# EAGLE design ade7953 (EAGLE 7.2.0)
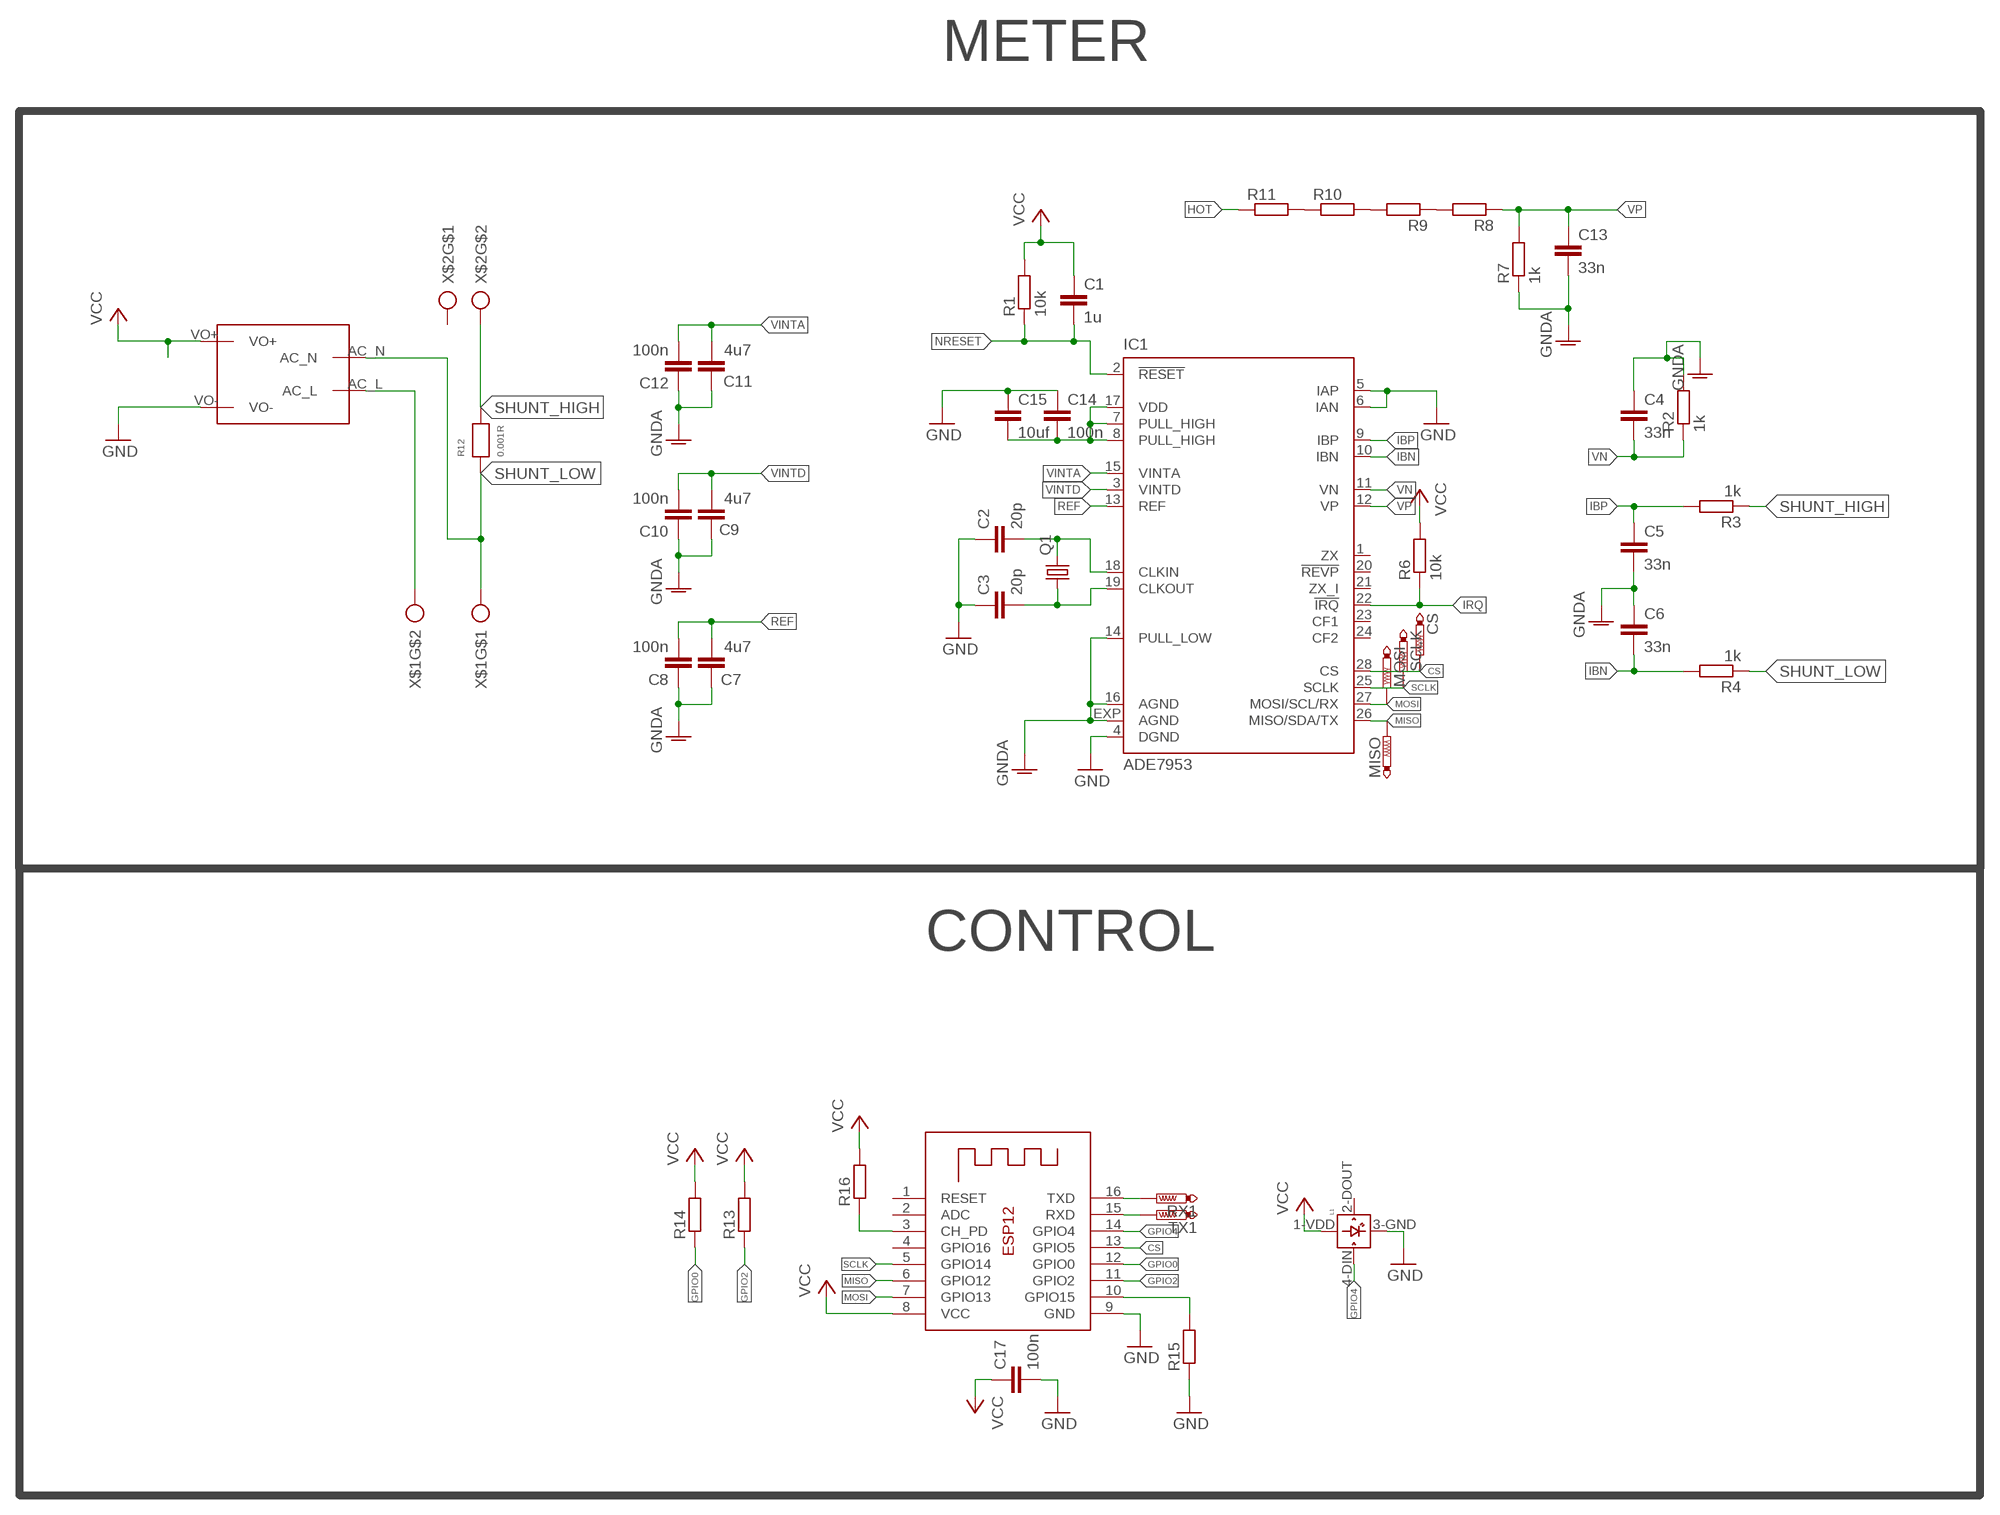
[diagram p0: schematic, sheet 1]

## Parts
C1  1u  C-EUC0805  [C0805]
C2  20p  C-EUC0805  [C0805]
C3  20p  C-EUC0805  [C0805]
C4  33n  C-EUC0805  [C0805]
C5  33n  C-EUC0805  [C0805]
C6  33n  C-EUC0805  [C0805]
C7  4u7  C-EUC0805  [C0805]
C8  100n  C-EUC0805  [C0805]
C9  4u7  C-EUC0805  [C0805]
C10  100n  C-EUC0805  [C0805]
C11  4u7  C-EUC0805  [C0805]
C12  100n  C-EUC0805  [C0805]
C13  33n  C-EUC0805  [C0805]
C14  100n  C-EUC0805  [C0805]
C15  10uf  C-EUC0805  [C0805]
C17  100n  C-EUC0805  [C0805]
CS  PTR1B1,27  [B1,27]
IC1  ADE7953  [QFN28-ML]
L1  WS2812B  [WS2812B]
MISO  PTR1B1,27  [B1,27]
MOSI  PTR1B1,27  [B1,27]
Q1  CRYSTALHC49UP  [HC49UP]
R1  10k  R-EU_R0805  [R0805]
R2  1k  R-EU_R0805  [R0805]
R3  1k  R-EU_R0805  [R0805]
R4  1k  R-EU_R0805  [R0805]
R6  10k  R-EU_R0805  [R0805]
R7  1k  R-EU_R0805  [R0805]
R8  R-EU_R0805  [R0805]
R9  R-EU_R0805  [R0805]
R10  R-EU_R1206  [R1206]
R11  R-EU_R1206  [R1206]
R12  0.001R  WSR-2_SHUNT  [WRS-2_4527]
R13  R-EU_R0603  [R0603]
R14  R-EU_R0603  [R0603]
R15  R-EU_R0603  [R0603]
R16  R-EU_R0603  [R0603]
RX1  PTR1B1,27  [B1,27]
SCLK  PTR1B1,27  [B1,27]
TX1  PTR1B1,27  [B1,27]
U$1  MAINS_CONVERTERS  [HLK-PM01]
X3  ESP-12  [ESP-12]
X$1  ARK2  [ARK2]
X$2  ARK2  [ARK2]

## Nets
CLKIN: C2.2 IC1.18(CLKIN) Q1.2
CLKOUT: C3.2 IC1.19(CLKOUT) Q1.1
CS: CS.TP IC1.28(CS) X3.13(GPIO5)
GND: C2.1 C3.1 C14.1 C15.1 C17.2 IC1.4(DGND) IC1.5(IAP) IC1.6(IAN) L1.3-GND(GND) R15.1 U$1.VO- X3.9(GND)
GNDA: C4.1 C5.2 C6.1 C7.1 C8.1 C9.1 C10.1 C11.1 C12.1 C13.2 IC1.14(PULL_LOW) IC1.16(AGND) IC1.EXP(AGND) R2.2 R7.1
GPIO0: R14.1 X3.12(GPIO0)
GPIO2: R13.1 X3.11(GPIO2)
GPIO4: L1.4-DIN(DIN) X3.14(GPIO4)
GPIO15: R15.2 X3.10(GPIO15)
HOT: R11.1 U$1.AC_L X$1.2
IBN: C6.2 IC1.10(IBN) R4.2
IBP: C5.1 IC1.9(IBP) R3.2
IRQ: IC1.22(!IRQ!) R6.1
MISO: IC1.26(MISO/SDA/TX) MISO.TP X3.6(GPIO12)
MOSI: IC1.27(MOSI/SCL/RX) MOSI.TP X3.7(GPIO13)
N$1: R9.2 R10.2
N$2: R10.1 R11.2
N$4: R16.1 X3.3(CH_PD)
N$12: R8.2 R9.1
NRESET: C1.2 IC1.2(!RESET!) R1.1
REF: C7.2 C8.2 IC1.13(REF)
RX: TX1.TP X3.15(RXD)
SCLK: IC1.25(SCLK) SCLK.TP X3.5(GPIO14)
SHUNT_HIGH: R3.1 R12.2 X$2.2
SHUNT_LOW: R4.1 R12.1 U$1.AC_N X$1.1
TX: RX1.TP X3.16(TXD)
VCC: C1.1 C14.2 C15.2 C17.1 IC1.7(PULL_HIGH) IC1.8(PULL_HIGH) IC1.17(VDD) L1.1-VDD(VDD) R1.2 R6.2 R13.2 R14.2 R16.2 U$1.VO+ X3.8(VCC)
VINTA: C11.2 C12.2 IC1.15(VINTA)
VINTD: C9.2 C10.2 IC1.3(VINTD)
VN: C4.2 IC1.11(VN) R2.1
VP: C13.1 IC1.12(VP) R7.2 R8.1
Unconnected: IC1.1(ZX) IC1.20(!REVP!) IC1.21(ZX_I) IC1.23(CF1) IC1.24(CF2) L1.2-DOUT(DOUT) X3.1(RESET) X3.2(ADC) X3.4(GPIO16) X$2.1

## Notes on the sheet
- METER
- CONTROL

## Library data of the parts
C1-C15 C17 = rcl:C-EU: CAPACITOR, European symbol
CS MISO MOSI RX1 SCLK TX1 = testpad:PTR1: TEST PIN
IC1 = ADE7953:ADE7953: Single Phase, Multifunction Metering IC with Neutral Current Measurement Source: http://www.analog.com/static/imported-files/data_sheets/ADE7953.pdf http://www.analog.com/static/imported-files/jp/data_sheets/ADE7953_jp.pdf
L1 = adafruit:WS2812B
Q1 = adafruit:CRYSTAL: CRYSTAL; OC_FARNELL: unknown; OC_NEWARK: unknown
R1-R4 R6-R11 R13-R16 = rcl:R-EU_: RESISTOR, European symbol
R12 = WSR-2_SHUNT:WSR-2_SHUNT
U$1 = _HLK:MAINS_CONVERTERS
X3 = adafruit:ESP-12
X$1 X$2 = _ARK:ARK2

## Board
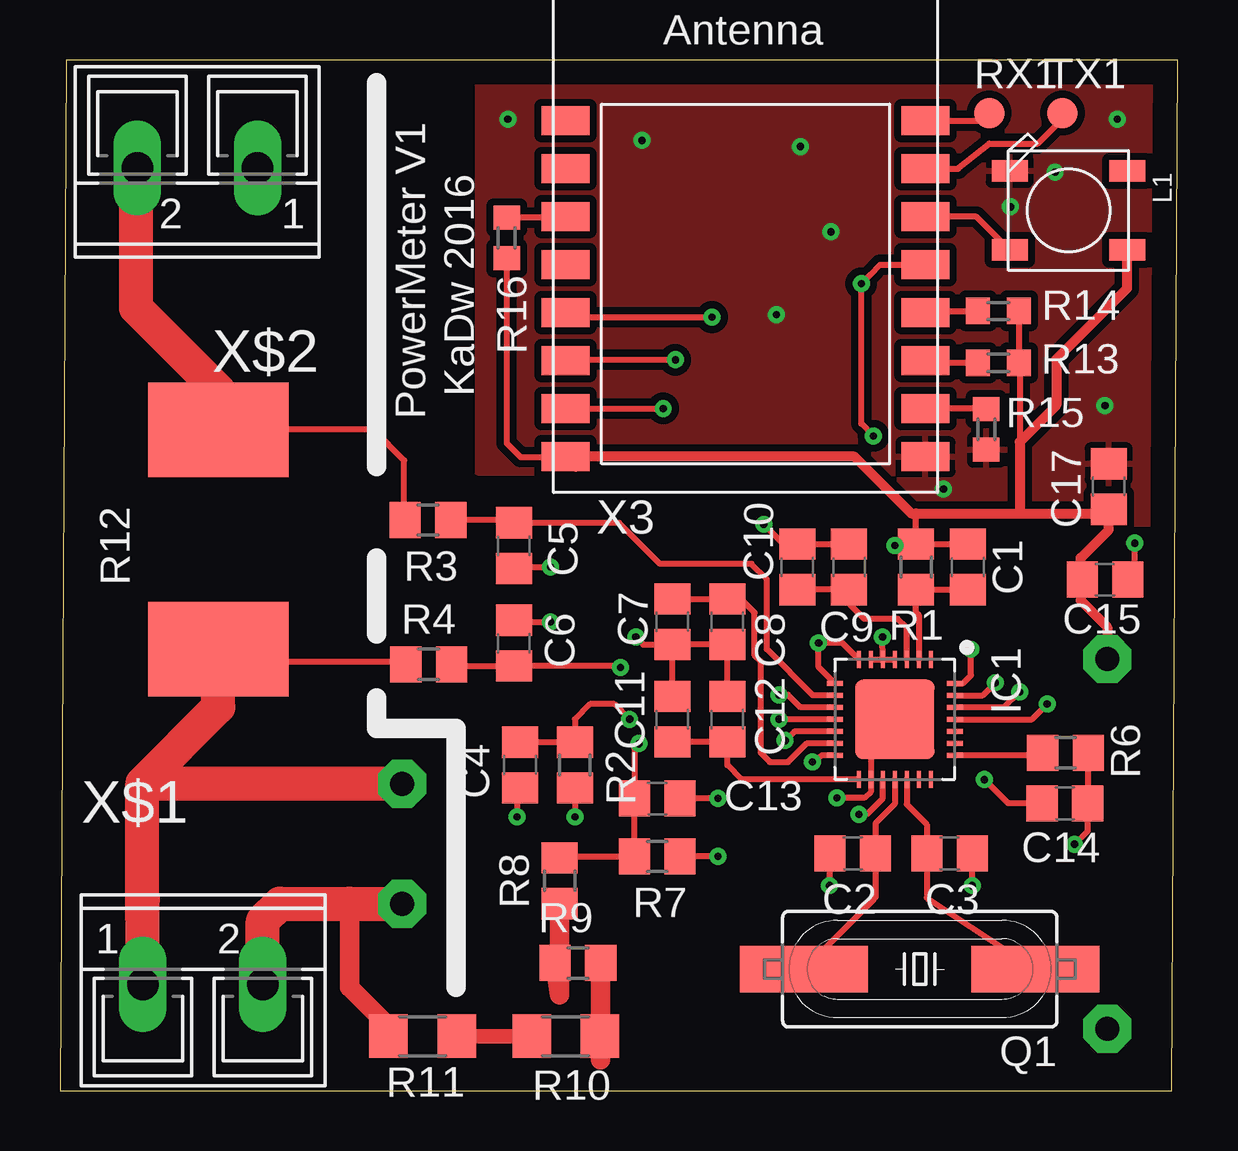
[diagram p1: board, top side]
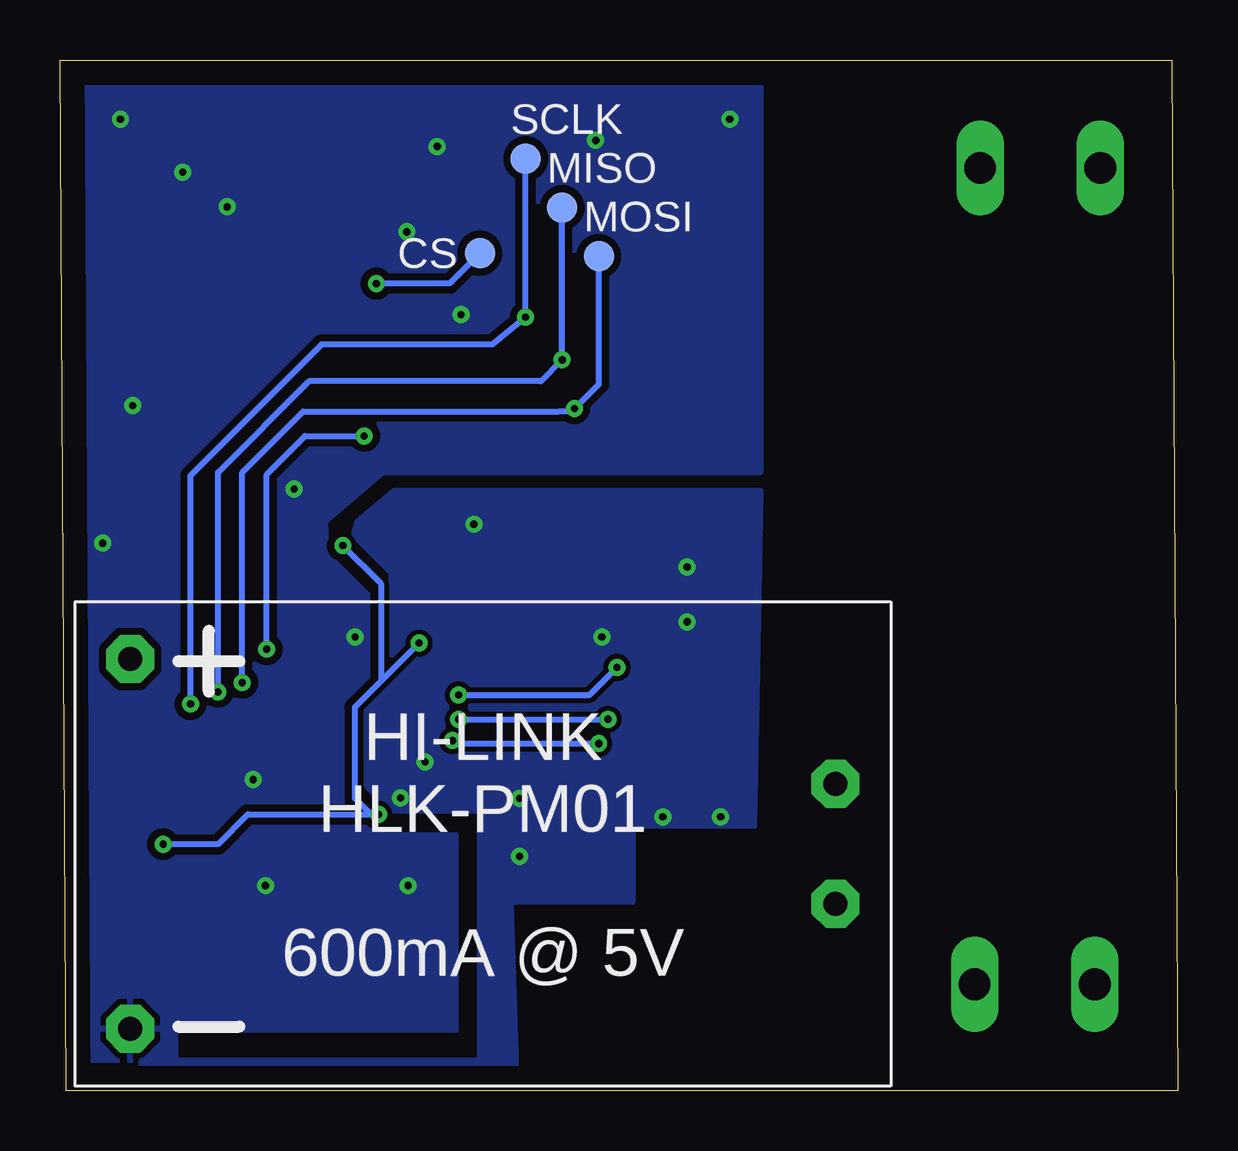
[diagram p2: board, bottom side, seen from below]

Size 46.59 x 42.98 mm. Coordinates in mm from the lower left corner, seen from the top.
Outline: 0,0 46.34,0 46.59,42.98 0.25,42.98 0,0
Copper layers (1*16): Top 0.035mm / dielectric 1.5mm / Bottom 0.035mm
Design rules "default": minimum track width 10mil, minimum drill 24mil, track to track 8mil, track to pad 8mil, pad to pad 8mil, via to via 8mil, smd to smd 8mil, copper to edge 40mil, drill to drill 8mil, minimum pad ring 10mil, minimum via ring 8mil, stop-mask expansion 4mil, vias tented up to drill 0mil, thermal gap 10mil

### Footprints (pad centres in the part's own frame; a part is rotated, then mirrored left to right if it is on the bottom)
C0805 = smd 1.3 x 1.5: 1 -0.95,0; 2 0.95,0
B1,27 = smd 1.27 x 1.27: TP 0,0
QFN28-ML = smd 0.7 x 0.2: 1 -2.5,1.5; 2 -2.5,1; 3 -2.5,0.5; 4 -2.5,0; 5 -2.5,-0.5; 6 -2.5,-1; 7 -2.5,-1.5; 15 2.5,-1.5; 16 2.5,-1; 17 2.5,-0.5; 18 2.5,0; 19 2.5,0.5; 20 2.5,1; 21 2.5,1.5 | smd 0.2 x 0.7: 8 -1.5,-2.5; 9 -1,-2.5; 10 -0.5,-2.5; 11 0,-2.5; 12 0.5,-2.5; 13 1,-2.5; 14 1.5,-2.5; 22 1.5,2.5; 23 1,2.5; 24 0.5,2.5; 25 0,2.5; 26 -0.5,2.5; 27 -1,2.5; 28 -1.5,2.5 | smd 3.3 x 3.3: EXP 0,0
WS2812B = smd 1.5 x 0.9: 1-VDD 2.45,-1.65; 2-DOUT 2.45,1.65; 3-GND -2.45,1.65; 4-DIN -2.45,-1.65
HC49UP = smd 5.334 x 1.93: 1 -4.826,0; 2 4.826,0
R0805 = smd 1.3 x 1.5: 1 -0.95,0; 2 0.95,0
R1206 = smd 1.6 x 1.803: 1 -1.422,0; 2 1.422,0
WRS-2_4527 = smd 3.94 x 5.84: 1 -4.575,0; 2 4.575,0
R0603 = smd 1 x 1.1: 1 -0.85,0; 2 0.85,0
HLK-PM01 = drill 1 pad 2 octagon: AC_L -14.7,2.5; AC_N -14.7,-2.5; VO+ 14.7,-7.7; VO- 14.7,7.7
ESP-12 = smd 2 x 1.2: 1 -7.5,4.5; 2 -7.5,2.5; 3 -7.5,0.5; 4 -7.5,-1.5; 5 -7.5,-3.5; 6 -7.5,-5.5; 7 -7.5,-7.5; 8 -7.5,-9.5; 9 7.5,-9.5; 10 7.5,-7.5; 11 7.5,-5.5; 12 7.5,-3.5; 13 7.5,-1.5; 14 7.5,0.5; 15 7.5,2.5; 16 7.5,4.5
ARK2 = drill 1.321 long: 1 -2.515,0; 2 2.489,0

### Placement (x,y rotation side)
C1  37.85,21.84 270 top
C2  33.05,9.91 0 top
C3  37.08,9.91 180 top
C4  19.18,13.59 90 top
C5  18.92,22.73 270 top
C6  18.92,18.67 270 top
C7  25.53,19.56 90 top
C8  27.81,19.56 90 top
C9  32.89,21.84 270 top
C10  30.73,21.84 270 top
C11  25.53,15.49 270 top
C12  27.81,15.49 270 top
C13  24.89,12.19 0 top
C14  41.88,11.99 0 top
C15  43.56,21.31 180 top
C17  43.71,25.2 90 top
CS  29.08,34.92 0 bottom
IC1  34.8,15.49 270 top
L1  42.04,36.7 0 top
MISO  25.65,36.83 0 bottom
MOSI  24.13,34.8 0 bottom
Q1  35.84,5.08 180 top
R1  35.69,21.84 90 top
R2  21.46,13.59 270 top
R3  15.34,23.8 0 top
R4  15.37,17.78 0 top
R6  41.91,14.1 0 top
R7  24.89,9.78 180 top
R8  20.83,8.76 270 top
R9  21.59,5.33 0 top
R10  21.08,2.29 0 top
R11  15.11,2.29 0 top
R12  6.6,22.99 90 top
R13  39.12,30.35 0 top
R14  39.12,32.51 0 top
R15  38.61,27.58 90 top
R16  18.62,35.56 270 top
RX1  38.73,40.77 0 top
SCLK  27.18,38.86 0 bottom
TX1  41.78,40.77 0 top
U$1  28.96,10.3 180 bottom
X3  28.57,35.94 0 top
X$1  5.97,4.45 0 top
X$2  5.71,38.48 180 top

### Tracks (layer width: path | path; a pad name or v marks a point on that pad's centre or on a via)
CLKIN
  Top 0.254: IC1.18 34.8,11.96 33.99,11.16 C2.2 33.99,8.09 33.91,8 33.91,7.98 Q1.2
CLKOUT
  Top 0.254: IC1.19 35.3,11.95 36.13,11.11 C3.2 36.13,8.06 36.2,8 Q1.1
CS  (via drill 0.3)
  Top 0.254: IC1.28 arc90 IC1.28 37.64,16.99 37.97,17.32 v37.97,18.41 | v33.91,27.3 33.4,27.81 v33.4,33.65 33.78,34.04 34.19,34.44 X3.13
  Bottom 0.254: v37.97,18.41 37.97,25.7 36.37,27.3 v33.91,27.3 | CS.TP 30.35,33.65 v33.4,33.65
GND  (via drill 0.3)
  Top 0.254: IC1.6 IC1.5 | IC1.5 IC1.4 | IC1.5 v34.29,18.92 | C2.1 32.08,8.88 v32.08,8.56 | v38.02,8.56 38.03,8.7 C3.1 | C14.1 39.52,11.99 v38.53,12.98 | C15.1 44.81,21.6 v44.81,22.84
  other vias: 18.67,40.51 24.26,39.62 43.56,28.57 41.48,38.3 32.13,35.81 36.83,25.1 30.86,39.37 29.87,32.36 44.07,40.51 39.62,36.86
  pour Bottom (isolate 0.305): 17.4,43.69 17.4,25.78 33.15,25.78 35.56,23.72 35.43,22.35 33.78,20.7 33.78,17.15 34.8,16.13 34.8,12.32 33.15,10.67 30.1,10.67 30.1,2.54 41.78,2.54 41.78,1.27 47.12,1.27 47.12,43.69
  pour Top (isolate 0.305): 17.4,43.31 17.4,25.78 33.15,25.78 35.56,23.72 48.51,23.62 48.51,43.31
GNDA  (via drill 0.3)
  Top 0.254: v27.43,12.19 C13.2 | v27.43,9.78 R7.1 | R2.2 v21.46,11.43 | C4.1 19.05,12.51 v19.05,11.43 | C6.1 18.98,19.56 v20.45,19.56 | C5.2 18.98,21.84 v20.45,21.84 | v24,18.92 24.32,18.61 C7.1 | C11.1 C7.1 | C12.1 C8.1 C7.1 | C9.1 C10.1 30.67,22.73 30.23,22.73 v29.34,23.62 | 32.3,12.28 v32.38,12.22 33.53,12.22 33.8,12.46 IC1.16 33.8,14.49 IC1.EXP | IC1.14 31.77,13.99 v31.37,13.72
  pour Bottom: 17.4,25.02 17.65,11.05 22.73,11.05 22.73,7.87 27.81,7.87 27.56,0.25 43.18,0.25 43.18,1.27 29.08,1.27 29.08,11.68 32.77,11.68 33.78,12.7 33.78,16 32.77,17.02 32.77,21.59 34.29,23.11 34.29,23.37 34.16,23.75 32.64,25.02
GPIO0
  Top 0.254: X3.12 36.15,32.51 R14.1
GPIO2
  Top 0.254: X3.11 36.16,30.35 R13.1
GPIO4
  Top 0.254: L1.4-DIN 38.2,36.44 X3.14
GPIO15
  Top 0.254: R15.2 X3.10
HOT
  Top 0.813: 12.06,7.8 12.06,4.32 13.69,2.69 R11.1
  Top 1.422: U$1.AC_L 12.06,7.8 9.17,7.8 8.46,7.09 X$1.2
IBN  (via drill 0.3)
  Top 0.254: IC1.10 30.87,15.99 30.35,16.51 v29.97,16.51 | v23.37,17.65 23.3,17.72 19.43,17.72 C6.2 16.38,17.72 R4.2
  Bottom 0.254: v29.97,16.51 24.51,16.51 v23.37,17.65
IBP
  Top 0.254: IC1.9 31.38,16.49 29.46,18.41 29.46,21.34 28.83,21.97 25.02,21.97 23.31,23.68 C5.1 18.81,23.8 R3.2
IRQ
  Top 0.254: R6.1 40.86,13.99 IC1.22
MISO  (via drill 0.3)
  Top 0.254: IC1.26 39.37,16 v40.01,16.64 | X3.6 21.11,30.48 v25.65,30.48
  Bottom 0.254: MISO.TP v25.65,30.48 26.54,29.59 36.2,29.59 40.01,25.78 v40.01,16.64
MOSI  (via drill 0.3)
  Top 0.254: IC1.27 38.47,16.49 v38.99,17.02 | X3.7 21.08,28.45 v25.15,28.45
  Bottom 0.254: v38.99,17.02 38.99,25.78 36.45,28.32 25.78,28.32 25.27,28.32 v25.15,28.45 24.13,29.46 MOSI.TP
N$1
  Top 0.813: R10.2 22.54,1.31 R9.2
N$2
  Top 0.61: R11.2 R10.1
N$4
  Top 0.254: X3.3 21.07,36.41 R16.1
N$12
  Top 0.61: 20.77,7.62 R8.2
  Top 0.813: R9.1 20.83,4 R8.2
NRESET
  Top 0.254: IC1.2 35.81,18.01 35.81,19.81 35.69,19.94 R1.1 C1.2
REF
  Top 0.254: IC1.13 32.28,14.48 31.11,14.48 30.35,13.72 29.59,13.72 29.21,14.1 29.21,17.91 28.96,18.16 28.96,19.94 28.39,20.51 C8.2 C7.2
RX
  Top 0.254: X3.15 37.43,38.44 arc90 37.47,38.48 38.73,39.5 40.77,39.5 41.78,40.51 TX1.TP
SCLK  (via drill 0.3)
  Top 0.254: IC1.25 40.51,15.49 v41.15,16.13 | X3.5 21.26,32.26 v27.18,32.26
  Bottom 0.254: SCLK.TP v27.18,32.26 28.57,31.12 35.69,31.12 41.15,25.65 v41.15,16.13
SHUNT_HIGH
  Top 0.254: R3.1 14.35,23.84 14.35,26.29 13.08,27.56 R12.2
  Top 0.61: R12.2 7.5,26.67
  Top 1.422: R12.2 6.6,29.21 3.17,32.64 3.17,38.43 X$2.2
SHUNT_LOW
  Top 0.254: R12.1 7.11,17.91 14.29,17.91 R4.1
  Top 0.61: R12.1 6.73,18.54
  Top 1.422: 3.43,7.11 3.43,8 | 3.43,8 3.43,12.57 | 3.43,12.57 3.43,12.83 6.6,16 R12.1 6.6,19.18 | U$1.AC_N 3.66,12.8 3.43,12.57 | X$1.1 3.45,7.98 3.43,8
TX
  Top 0.254: X3.16 38.41,40.44 arc90 RX1.TP
VCC  (via drill 0.3)
  Top 0.254: IC1.8 31.62,17.67 v31.62,18.67 32.62,18.67 IC1.7 | 37.97,22.92 C1.1 R1.2 | R1.2 35.63,22.73 v34.8,22.73 | R14.2 R13.2 40.01,30.31 40.01,27.18 40.13,27.18 | R16.2 18.62,27 19.2,26.42 21.05,26.42 X3.8 | R1.2 35.69,24.08 | v42.29,10.29 42.84,10.83 C14.2 42.86,12.01 R6.2 | v33.31,11.53 33.63,11.53 34.3,12.2 IC1.17
  Top 0.406: 21.51,26.01 X3.8 33.12,26.44 35.48,24.08 35.69,24.08 40.01,24.08 | 43.66,24.19 C17.1 | C17.1 arc-90 43.55,24.08 40.01,24.08 | L1.1-VDD 44.48,35.04 44.48,33.45 41.53,30.51 41.53,28.57 40.13,27.18 40.01,27.05 40.01,24.08 | C17.1 43.71,23.39 42.55,22.23 42.55,21.38 C15.2 arc90 42.55,21.24 42.55,20.45 43.66,19.34 U$1.VO+
  Bottom 0.254: v31.62,18.67 33.21,17.08 | 33.21,17.08 34.3,15.99 34.29,15.99 34.29,12.19 33.63,11.53 v33.31,11.53 38.76,11.53 40.01,10.29 v42.29,10.29 | v34.8,22.73 33.21,21.15 33.21,17.08
VINTA
  Top 0.254: IC1.15 28.41,12.99 27.81,13.59 C12.2 C11.2
VINTD
  Top 0.254: C9.2 32.32,20.89 | 32.32,20.89 C10.2 | IC1.3 35.3,19.31 34.92,19.68 33.53,19.68 32.32,20.89
VN  (via drill 0.3)
  Top 0.254: C4.2 R2.1 21.46,15.49 22.1,16.13 23.11,16.13 v23.75,15.49 | IC1.11 v29.97,15.49
  Bottom 0.254: v29.97,15.49 v23.75,15.49
VP  (via drill 0.3)
  Top 0.254: C13.1 R7.2 20.89,9.78 R8.1 | C13.1 24,12.25 | IC1.12 30.61,14.99 v30.23,14.6 | v24.13,14.48 23.94,14.29 C13.1
  Bottom 0.254: v30.23,14.6 30.1,14.48 v24.13,14.48

### Text on the board
tNames: PowerMeter V1 | KaDw 2016